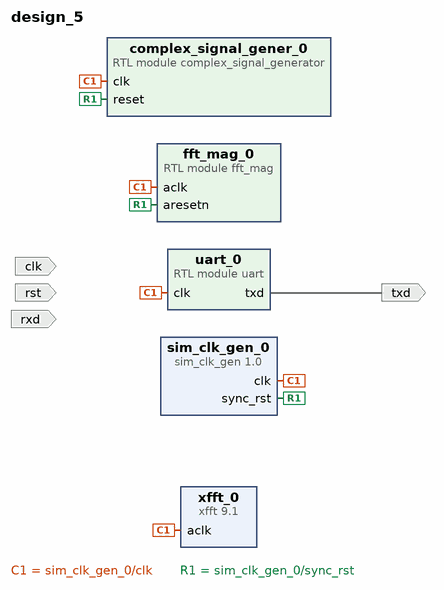
[diagram p0: block diagram of the top level]
# Vivado block design design_5, xc7a35tcpg236-1, Vivado 2023.2
create_bd_design design_5

create_bd_port -dir I -type clk clk
set_property -dict {CONFIG.FREQ_HZ 100000000} [get_bd_ports clk]
create_bd_port -dir I -type rst rst
create_bd_port -dir O txd
create_bd_port -dir I rxd

create_bd_cell -type ip -vlnv xilinx.com:ip:sim_clk_gen:1.0 sim_clk_gen_0
create_bd_cell -type module -reference uart uart_0
create_bd_cell -type ip -vlnv xilinx.com:ip:xfft:9.1 xfft_0
create_bd_cell -type module -reference complex_signal_generator complex_signal_gener_0
create_bd_cell -type module -reference fft_mag fft_mag_0

# ---- connections ----

connect_bd_net [get_bd_pins sim_clk_gen_0/clk] \
  [get_bd_pins uart_0/clk] [get_bd_pins fft_mag_0/aclk] [get_bd_pins xfft_0/aclk] [get_bd_pins complex_signal_gener_0/clk]
connect_bd_net [get_bd_pins sim_clk_gen_0/sync_rst] [get_bd_pins fft_mag_0/aresetn] [get_bd_pins complex_signal_gener_0/reset]
connect_bd_net [get_bd_pins uart_0/txd] [get_bd_ports txd]

validate_bd_design
save_bd_design
